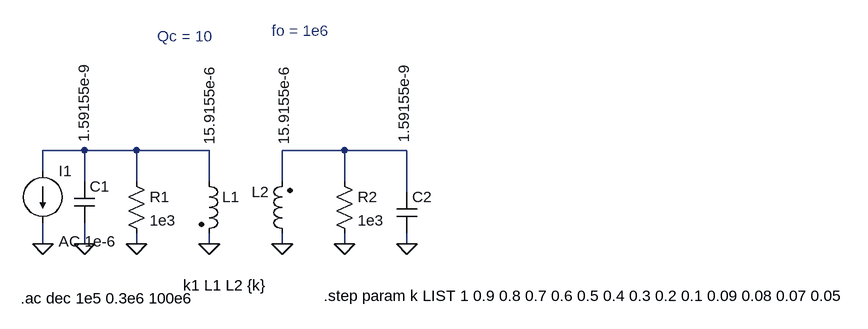
[diagram p0: schematic Doble_acopla_L.asc]
Doble_acopla_L.asc, the LTspice schematic file:
Version 4
SHEET 1 1200 680
WIRE -80 64 -144 64
WIRE 0 64 -80 64
WIRE 112 64 0 64
WIRE 320 64 224 64
WIRE 416 64 320 64
WIRE -144 96 -144 64
WIRE -80 112 -80 64
WIRE 0 112 0 64
WIRE 112 112 112 64
WIRE 224 112 224 64
WIRE 320 112 320 64
WIRE 416 128 416 64
WIRE -144 208 -144 176
WIRE -80 208 -80 176
WIRE 0 208 0 192
WIRE 112 208 112 192
WIRE 224 208 224 192
WIRE 320 208 320 192
WIRE 416 208 416 192
FLAG -144 208 0
FLAG -80 208 0
FLAG 0 208 0
FLAG 112 208 0
FLAG 224 208 0
FLAG 320 208 0
FLAG 416 208 0
SYMBOL ind2 96 96 R0
WINDOW 3 131 -40 VLeft 2
SYMATTR InstName L1
SYMATTR Value 15.9155e-6
SYMATTR Type ind
SYMBOL ind2 240 208 R180
WINDOW 0 36 80 Left 2
WINDOW 3 128 152 VRight 2
SYMATTR InstName L2
SYMATTR Value 15.9155e-6
SYMATTR Type ind
SYMBOL res -16 96 R0
SYMATTR InstName R1
SYMATTR Value 1e3
SYMBOL res 304 96 R0
SYMATTR InstName R2
SYMATTR Value 1e3
SYMBOL cap -96 112 R0
WINDOW 3 15 -60 VLeft 2
SYMATTR InstName C1
SYMATTR Value 1.59155e-9
SYMBOL cap 400 128 R0
WINDOW 3 11 -75 VLeft 2
SYMATTR InstName C2
SYMATTR Value 1.59155e-9
SYMBOL current -144 96 R0
WINDOW 123 24 108 Left 2
WINDOW 39 0 0 Left 2
SYMATTR InstName I1
SYMATTR Value ""
SYMATTR Value2 AC 1e-6
TEXT 72 272 Left 2 !k1 L1 L2 {k}
TEXT 32 -112 Left 2 ;Qc = 10
TEXT 208 -120 Left 2 ;fo = 1e6
TEXT -178 292 Left 2 !.ac dec 1e5 0.3e6 100e6
TEXT 288 288 Left 2 !.step param k LIST 1 0.9 0.8 0.7 0.6 0.5 0.4 0.3 0.2 0.1 0.09 0.08 0.07 0.05

The netlist it stands for:
* Doble_acopla_L.asc
L1 N001 0 15.9155e-6
L2 0 N002 15.9155e-6
R1 N001 0 1e3
R2 N002 0 1e3
C1 N001 0 1.59155e-9
C2 N002 0 1.59155e-9
I1 N001 0 AC 1e-6
k1 L1 L2 {k}
* Qc = 10
* fo = 1e6
.ac dec 1e5 0.3e6 100e6
.step param k LIST 1 0.9 0.8 0.7 0.6 0.5 0.4 0.3 0.2 0.1 0.09 0.08 0.07 0.05
.backanno
.end